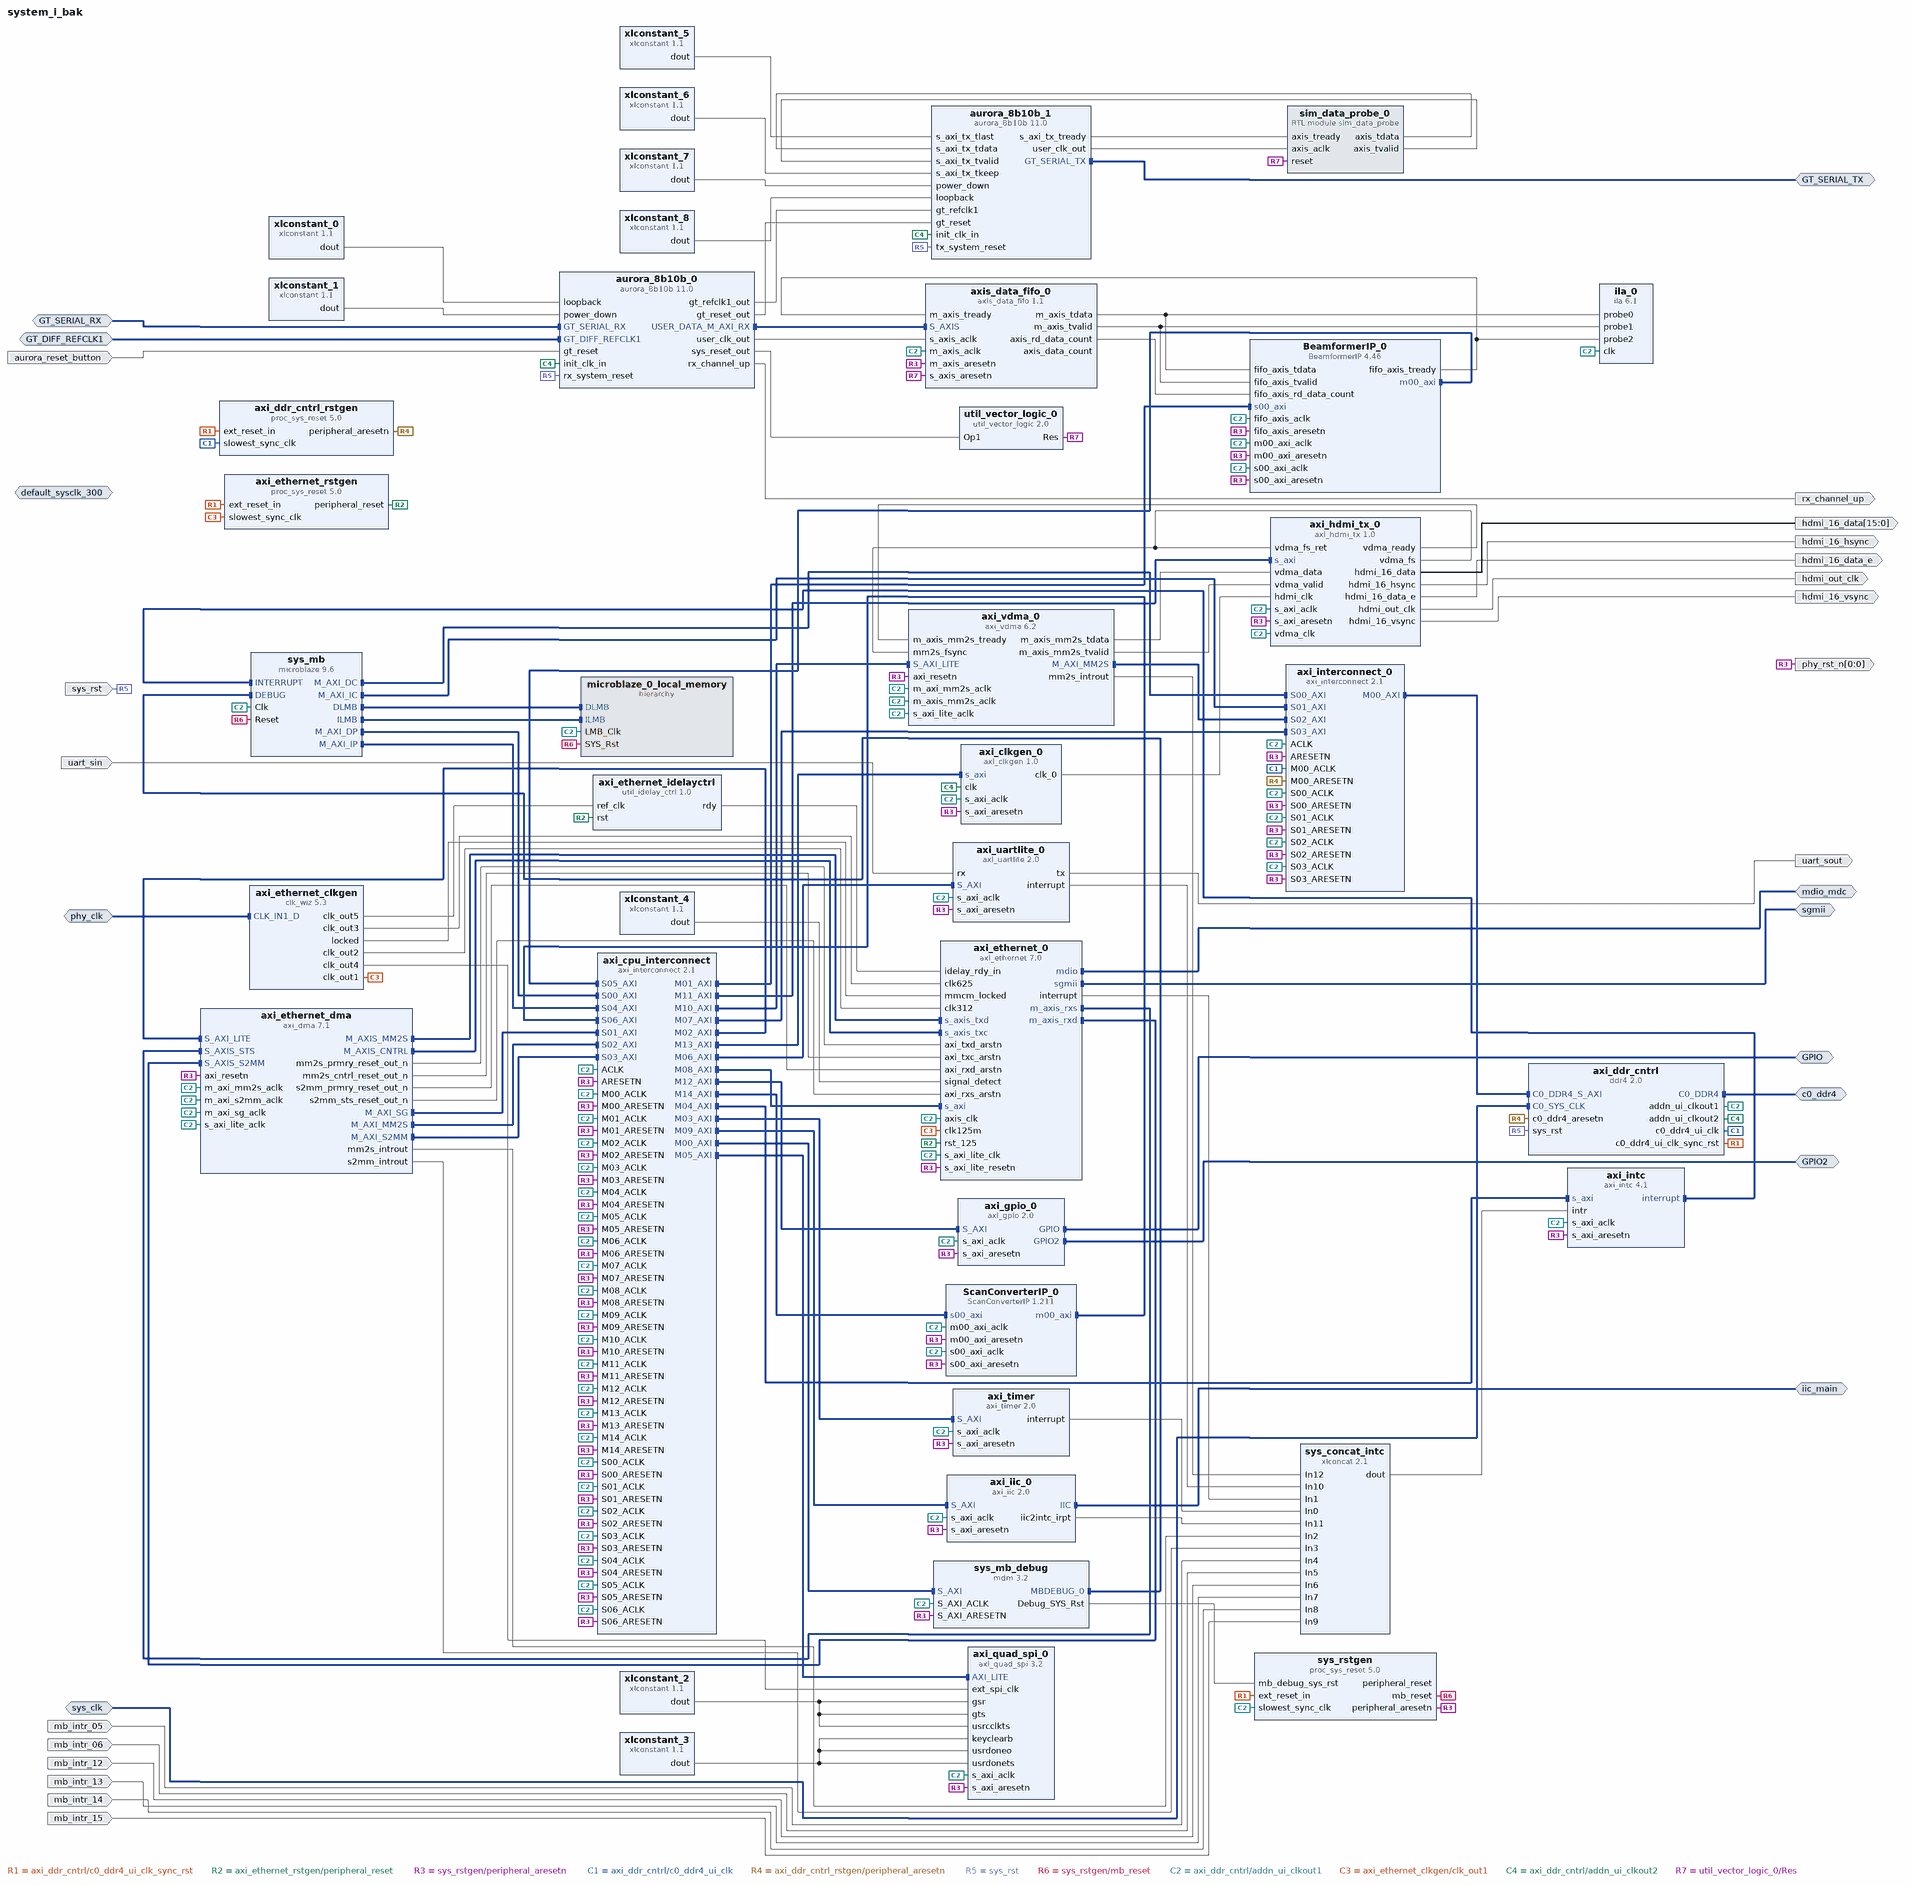
[diagram p0: block diagram of the top level]
# Vivado block design system_i_bak, Vivado 2016.1
create_bd_design system_i_bak

create_bd_intf_port -mode Master -vlnv xilinx.com:interface:ddr4_rtl:1.0 c0_ddr4
create_bd_intf_port -mode Slave -vlnv xilinx.com:interface:diff_clock_rtl:1.0 phy_clk
set_property -dict {CONFIG.FREQ_HZ 625000000} [get_bd_intf_ports phy_clk]
create_bd_intf_port -mode Slave -vlnv xilinx.com:interface:diff_clock_rtl:1.0 sys_clk
set_property -dict {CONFIG.FREQ_HZ 300000000} [get_bd_intf_ports sys_clk]
create_bd_intf_port -mode Master -vlnv xilinx.com:interface:mdio_rtl:1.0 mdio_mdc
create_bd_intf_port -mode Master -vlnv xilinx.com:interface:sgmii_rtl:1.0 sgmii
create_bd_intf_port -mode Master -vlnv xilinx.com:interface:iic_rtl:1.0 iic_main
create_bd_intf_port -mode Slave -vlnv xilinx.com:display_aurora:GT_Serial_Transceiver_Pins_RX_rtl:1.0 GT_SERIAL_RX
create_bd_intf_port -mode Slave -vlnv xilinx.com:interface:diff_clock_rtl:1.0 GT_DIFF_REFCLK1
set_property -dict {CONFIG.FREQ_HZ 125000000} [get_bd_intf_ports GT_DIFF_REFCLK1]
create_bd_intf_port -mode Master -vlnv xilinx.com:interface:gpio_rtl:1.0 GPIO
create_bd_intf_port -mode Master -vlnv xilinx.com:interface:gpio_rtl:1.0 GPIO2
create_bd_intf_port -mode Master -vlnv xilinx.com:display_aurora:GT_Serial_Transceiver_Pins_TX_rtl:1.0 GT_SERIAL_TX
create_bd_intf_port -mode Slave -vlnv xilinx.com:interface:diff_clock_rtl:1.0 default_sysclk_300
set_property -dict {CONFIG.FREQ_HZ 300000000} [get_bd_intf_ports default_sysclk_300]
create_bd_port -dir O uart_sout
create_bd_port -dir I -type intr mb_intr_05
create_bd_port -dir I -type intr mb_intr_06
create_bd_port -dir I -type intr mb_intr_12
create_bd_port -dir I -type intr mb_intr_13
create_bd_port -dir I -type intr mb_intr_14
create_bd_port -dir I -type intr mb_intr_15
create_bd_port -dir I uart_sin
create_bd_port -dir O -from 0 -to 0 -type rst phy_rst_n
create_bd_port -dir I -type rst sys_rst
set_property -dict {CONFIG.POLARITY ACTIVE_HIGH} [get_bd_ports sys_rst]
create_bd_port -dir O hdmi_out_clk
create_bd_port -dir O hdmi_16_hsync
create_bd_port -dir O hdmi_16_vsync
create_bd_port -dir O -from 15 -to 0 hdmi_16_data
create_bd_port -dir O hdmi_16_data_e
create_bd_port -dir O rx_channel_up
create_bd_port -dir I -type rst aurora_reset_button
set_property -dict {CONFIG.POLARITY ACTIVE_HIGH} [get_bd_ports aurora_reset_button]

create_bd_cell -type ip -vlnv xilinx.com:ip:axi_interconnect:2.1 axi_cpu_interconnect
set_property -dict [list \
  CONFIG.NUM_SI 7 \
  CONFIG.NUM_MI 15 \
  CONFIG.STRATEGY 1 \
  CONFIG.S00_HAS_DATA_FIFO 1 \
  CONFIG.S01_HAS_DATA_FIFO 1 \
  CONFIG.S02_HAS_DATA_FIFO 1 \
  CONFIG.S03_HAS_DATA_FIFO 1 \
  CONFIG.S04_HAS_DATA_FIFO 2 \
  CONFIG.S05_HAS_DATA_FIFO 2 \
  CONFIG.S06_HAS_DATA_FIFO 2 \
  CONFIG.S07_HAS_DATA_FIFO 1 \
  CONFIG.S08_HAS_DATA_FIFO 2 \
  CONFIG.S09_HAS_DATA_FIFO 2 \
] [get_bd_cells axi_cpu_interconnect]
create_bd_cell -type ip -vlnv xilinx.com:ip:ddr4:2.0 axi_ddr_cntrl
set_property -dict [list \
  CONFIG.RESET_BOARD_INTERFACE reset \
  CONFIG.C0_CLOCK_BOARD_INTERFACE Custom \
  CONFIG.C0_DDR4_BOARD_INTERFACE ddr4_sdram \
  CONFIG.C0.DDR4_TimePeriod 833 \
  CONFIG.C0.DDR4_InputClockPeriod 3332 \
  CONFIG.C0.DDR4_MemoryPart EDY4016AABG-DR-F \
  CONFIG.C0.DDR4_DataWidth 64 \
  CONFIG.C0.DDR4_CasWriteLatency 12 \
  CONFIG.C0.DDR4_Mem_Add_Map ROW_COLUMN_BANK \
  CONFIG.ADDN_UI_CLKOUT1_FREQ_HZ 133 \
  CONFIG.ADDN_UI_CLKOUT2_FREQ_HZ 200 \
  CONFIG.Debug_Signal Disable \
] [get_bd_cells axi_ddr_cntrl]
create_bd_cell -type ip -vlnv xilinx.com:ip:proc_sys_reset:5.0 axi_ddr_cntrl_rstgen
create_bd_cell -type ip -vlnv xilinx.com:ip:clk_wiz:5.3 axi_ethernet_clkgen
set_property -dict [list \
  CONFIG.PRIM_IN_FREQ 625.000 \
  CONFIG.CLKOUT2_USED true \
  CONFIG.CLKOUT3_USED true \
  CONFIG.CLKOUT4_USED true \
  CONFIG.CLKOUT5_USED true \
  CONFIG.CLKOUT6_USED false \
  CONFIG.NUM_OUT_CLKS 5 \
  CONFIG.CLKOUT1_REQUESTED_OUT_FREQ 125 \
  CONFIG.CLKOUT2_REQUESTED_OUT_FREQ 312 \
  CONFIG.CLKOUT3_REQUESTED_OUT_FREQ 625 \
  CONFIG.CLKOUT4_REQUESTED_OUT_FREQ 108 \
  CONFIG.CLKOUT5_REQUESTED_OUT_FREQ 208 \
  CONFIG.CLKOUT6_REQUESTED_OUT_FREQ 208 \
  CONFIG.PRIM_SOURCE Differential_clock_capable_pin \
  CONFIG.CLKOUT3_DRIVES BUFG \
  CONFIG.CLKOUT6_DRIVES BUFG \
  CONFIG.USE_LOCKED true \
  CONFIG.USE_RESET false \
  CONFIG.MMCM_DIVCLK_DIVIDE 2 \
  CONFIG.MMCM_CLKIN1_PERIOD 1.6 \
  CONFIG.MMCM_CLKOUT3_DIVIDE 12 \
  CONFIG.MMCM_CLKOUT4_DIVIDE 6 \
  CONFIG.MMCM_CLKOUT5_DIVIDE 1 \
  CONFIG.CLK_IN1_BOARD_INTERFACE sgmii_phyclk \
  CONFIG.RESET_BOARD_INTERFACE Custom \
  CONFIG.CLKOUT4_JITTER 99.367 \
  CONFIG.CLKOUT4_PHASE_ERROR 76.196 \
  CONFIG.CLKOUT5_JITTER 86.709 \
  CONFIG.CLKOUT5_PHASE_ERROR 76.196 \
  CONFIG.CLKOUT6_JITTER 86.709 \
  CONFIG.CLKOUT6_PHASE_ERROR 76.196 \
] [get_bd_cells axi_ethernet_clkgen]
create_bd_cell -type ip -vlnv xilinx.com:ip:axi_dma:7.1 axi_ethernet_dma
set_property -dict [list \
  CONFIG.c_sg_length_width 16 \
  CONFIG.c_include_mm2s_dre 1 \
  CONFIG.c_sg_use_stsapp_length 1 \
  CONFIG.c_include_s2mm_dre 1 \
] [get_bd_cells axi_ethernet_dma]
create_bd_cell -type ip -vlnv xilinx.com:ip:util_idelay_ctrl:1.0 axi_ethernet_idelayctrl
create_bd_cell -type ip -vlnv xilinx.com:ip:proc_sys_reset:5.0 axi_ethernet_rstgen
set_property -dict {CONFIG.RESET_BOARD_INTERFACE Custom} [get_bd_cells axi_ethernet_rstgen]
create_bd_cell -type ip -vlnv xilinx.com:ip:axi_intc:4.1 axi_intc
set_property -dict {CONFIG.C_HAS_FAST 0} [get_bd_cells axi_intc]
create_bd_cell -type ip -vlnv xilinx.com:ip:axi_timer:2.0 axi_timer
create_bd_cell -type ip -vlnv xilinx.com:ip:axi_uartlite:2.0 axi_uartlite_0
set_property -dict {CONFIG.UARTLITE_BOARD_INTERFACE rs232_uart} [get_bd_cells axi_uartlite_0]
create_bd_cell -type hier microblaze_0_local_memory
create_bd_cell -type ip -vlnv xilinx.com:ip:xlconcat:2.1 sys_concat_intc
set_property -dict {CONFIG.NUM_PORTS 13} [get_bd_cells sys_concat_intc]
create_bd_cell -type ip -vlnv xilinx.com:ip:microblaze:9.6 sys_mb
set_property -dict [list \
  CONFIG.C_D_LMB 1 \
  CONFIG.C_I_AXI 1 \
  CONFIG.C_I_LMB 1 \
  CONFIG.G_TEMPLATE_LIST 6 \
  CONFIG.G_USE_EXCEPTIONS 1 \
  CONFIG.C_USE_MSR_INSTR 1 \
  CONFIG.C_USE_PCMP_INSTR 1 \
  CONFIG.C_USE_REORDER_INSTR 1 \
  CONFIG.C_USE_BARREL 1 \
  CONFIG.C_USE_DIV 0 \
  CONFIG.C_USE_HW_MUL 1 \
  CONFIG.C_USE_FPU 0 \
  CONFIG.C_UNALIGNED_EXCEPTIONS 0 \
  CONFIG.C_ILL_OPCODE_EXCEPTION 0 \
  CONFIG.C_M_AXI_I_BUS_EXCEPTION 0 \
  CONFIG.C_M_AXI_D_BUS_EXCEPTION 1 \
  CONFIG.C_PVR 0 \
  CONFIG.C_DEBUG_ENABLED 1 \
  CONFIG.C_NUMBER_OF_PC_BRK 2 \
  CONFIG.C_OPCODE_0x0_ILLEGAL 0 \
  CONFIG.C_FSL_LINKS 0 \
  CONFIG.C_USE_ICACHE 1 \
  CONFIG.C_CACHE_BYTE_SIZE 4096 \
  CONFIG.C_ICACHE_LINE_LEN 8 \
  CONFIG.C_ICACHE_VICTIMS 0 \
  CONFIG.C_ICACHE_STREAMS 0 \
  CONFIG.C_USE_DCACHE 1 \
  CONFIG.C_DCACHE_BYTE_SIZE 4096 \
  CONFIG.C_DCACHE_LINE_LEN 4 \
  CONFIG.C_DCACHE_USE_WRITEBACK 0 \
  CONFIG.C_USE_MMU 3 \
  CONFIG.C_MMU_DTLB_SIZE 4 \
  CONFIG.C_MMU_ITLB_SIZE 2 \
  CONFIG.C_USE_BRANCH_TARGET_CACHE 0 \
] [get_bd_cells sys_mb]
create_bd_cell -type ip -vlnv xilinx.com:ip:mdm:3.2 sys_mb_debug
set_property -dict {CONFIG.C_USE_UART 1} [get_bd_cells sys_mb_debug]
create_bd_cell -type ip -vlnv xilinx.com:ip:proc_sys_reset:5.0 sys_rstgen
create_bd_cell -type ip -vlnv xilinx.com:ip:axi_quad_spi:3.2 axi_quad_spi_0
set_property -dict [list \
  CONFIG.C_SPI_MEMORY 2 \
  CONFIG.C_USE_STARTUP 1 \
  CONFIG.C_USE_STARTUP_INT 1 \
  CONFIG.C_SPI_MODE 2 \
] [get_bd_cells axi_quad_spi_0]
create_bd_cell -type ip -vlnv xilinx.com:ip:axi_ethernet:7.0 axi_ethernet_0
set_property -dict [list \
  CONFIG.ETHERNET_BOARD_INTERFACE sgmii \
  CONFIG.MDIO_BOARD_INTERFACE mdio_mdc \
  CONFIG.SupportLevel 0 \
  CONFIG.Statistics_Counters false \
  CONFIG.axiliteclkrate 133 \
  CONFIG.axisclkrate 133 \
] [get_bd_cells axi_ethernet_0]
create_bd_cell -type ip -vlnv xilinx.com:ip:axi_iic:2.0 axi_iic_0
set_property -dict {CONFIG.USE_BOARD_FLOW true CONFIG.IIC_BOARD_INTERFACE iic_main} [get_bd_cells axi_iic_0]
create_bd_cell -type ip -vlnv xilinx.com:ip:axi_vdma:6.2 axi_vdma_0
set_property -dict [list \
  CONFIG.c_m_axis_mm2s_tdata_width 64 \
  CONFIG.c_use_mm2s_fsync 1 \
  CONFIG.c_include_s2mm 0 \
] [get_bd_cells axi_vdma_0]
create_bd_cell -type ip -vlnv xilinx.com:ip:axi_gpio:2.0 axi_gpio_0
set_property -dict [list \
  CONFIG.C_GPIO_WIDTH 7 \
  CONFIG.C_GPIO2_WIDTH 4 \
  CONFIG.C_IS_DUAL 1 \
  CONFIG.C_ALL_INPUTS 0 \
  CONFIG.C_ALL_INPUTS_2 1 \
  CONFIG.USE_BOARD_FLOW true \
  CONFIG.GPIO_BOARD_INTERFACE Custom \
  CONFIG.GPIO2_BOARD_INTERFACE Custom \
  CONFIG.C_ALL_OUTPUTS 1 \
] [get_bd_cells axi_gpio_0]
create_bd_cell -type ip -vlnv analog.com:user:axi_hdmi_tx:1.0 axi_hdmi_tx_0
set_property -dict {CONFIG.DEVICE_TYPE 1} [get_bd_cells axi_hdmi_tx_0]
create_bd_cell -type ip -vlnv analog.com:user:axi_clkgen:1.0 axi_clkgen_0
create_bd_cell -type ip -vlnv xilinx.com:ip:aurora_8b10b:11.0 aurora_8b10b_0
set_property -dict [list \
  CONFIG.C_AURORA_LANES 4 \
  CONFIG.C_LINE_RATE 6.25 \
  CONFIG.Dataflow_Config RX-only_Simplex \
  CONFIG.Backchannel_mode Timer \
  CONFIG.C_START_QUAD Quad_X0Y4 \
  CONFIG.C_START_LANE X0Y16 \
  CONFIG.C_REFCLK_SOURCE {MGTREFCLK0 of Quad X0Y4} \
  CONFIG.SupportLevel 1 \
  CONFIG.C_USE_BYTESWAP true \
  CONFIG.CHANNEL_ENABLE {X0Y16 X0Y17 X0Y18 X0Y19} \
  CONFIG.C_DRP_IF false \
] [get_bd_cells aurora_8b10b_0]
create_bd_cell -type ip -vlnv xilinx.com:ip:util_vector_logic:2.0 util_vector_logic_0
set_property -dict {CONFIG.C_SIZE 1 CONFIG.C_OPERATION not} [get_bd_cells util_vector_logic_0]
create_bd_cell -type ip -vlnv xilinx.com:ip:axis_data_fifo:1.1 axis_data_fifo_0
set_property -dict {CONFIG.TDATA_NUM_BYTES 8 CONFIG.FIFO_DEPTH 32768 CONFIG.IS_ACLK_ASYNC 1} [get_bd_cells axis_data_fifo_0]
create_bd_cell -type ip -vlnv xilinx.com:ip:xlconstant:1.1 xlconstant_0
set_property -dict {CONFIG.CONST_WIDTH 3 CONFIG.CONST_VAL 0} [get_bd_cells xlconstant_0]
create_bd_cell -type ip -vlnv xilinx.com:ip:xlconstant:1.1 xlconstant_1
set_property -dict {CONFIG.CONST_WIDTH 1 CONFIG.CONST_VAL 0} [get_bd_cells xlconstant_1]
create_bd_cell -type ip -vlnv xilinx.com:ip:xlconstant:1.1 xlconstant_2
set_property -dict {CONFIG.CONST_VAL 0} [get_bd_cells xlconstant_2]
create_bd_cell -type ip -vlnv xilinx.com:ip:xlconstant:1.1 xlconstant_3
create_bd_cell -type ip -vlnv xilinx.com:ip:xlconstant:1.1 xlconstant_4
create_bd_cell -type ip -vlnv xilinx.com:ip:aurora_8b10b:11.0 aurora_8b10b_1
set_property -dict [list \
  CONFIG.C_AURORA_LANES 4 \
  CONFIG.C_LINE_RATE 6.25 \
  CONFIG.Dataflow_Config TX-only_Simplex \
  CONFIG.Backchannel_mode Timer \
  CONFIG.C_START_QUAD Quad_X0Y3 \
  CONFIG.C_START_LANE X0Y12 \
  CONFIG.C_REFCLK_SOURCE {MGTREFCLK0 of Quad X0Y3} \
  CONFIG.SINGLEEND_GTREFCLK true \
  CONFIG.SupportLevel 1 \
  CONFIG.C_USE_BYTESWAP true \
  CONFIG.CHANNEL_ENABLE {X0Y12 X0Y13 X0Y14 X0Y15} \
  CONFIG.C_DRP_IF false \
] [get_bd_cells aurora_8b10b_1]
create_bd_cell -type ip -vlnv xilinx.com:ip:xlconstant:1.1 xlconstant_5
create_bd_cell -type ip -vlnv xilinx.com:ip:xlconstant:1.1 xlconstant_6
set_property -dict {CONFIG.CONST_WIDTH 8 CONFIG.CONST_VAL 255} [get_bd_cells xlconstant_6]
create_bd_cell -type ip -vlnv xilinx.com:ip:xlconstant:1.1 xlconstant_7
set_property -dict {CONFIG.CONST_VAL 0} [get_bd_cells xlconstant_7]
create_bd_cell -type ip -vlnv xilinx.com:ip:xlconstant:1.1 xlconstant_8
set_property -dict {CONFIG.CONST_WIDTH 3 CONFIG.CONST_VAL 0} [get_bd_cells xlconstant_8]
create_bd_cell -type ip -vlnv xilinx.com:ip:ila:6.1 ila_0
set_property -dict [list \
  CONFIG.C_PROBE0_WIDTH 64 \
  CONFIG.C_NUM_OF_PROBES 3 \
  CONFIG.C_ADV_TRIGGER true \
  CONFIG.C_TRIGIN_EN true \
  CONFIG.C_ENABLE_ILA_AXI_MON false \
  CONFIG.C_MONITOR_TYPE Native \
] [get_bd_cells ila_0]
create_bd_cell -type ip -vlnv xilinx.com:ip:axi_interconnect:2.1 axi_interconnect_0
set_property -dict [list \
  CONFIG.NUM_SI 4 \
  CONFIG.NUM_MI 1 \
  CONFIG.STRATEGY 2 \
  CONFIG.S00_HAS_DATA_FIFO 2 \
  CONFIG.S01_HAS_DATA_FIFO 2 \
  CONFIG.S02_HAS_DATA_FIFO 2 \
  CONFIG.S03_HAS_DATA_FIFO 2 \
] [get_bd_cells axi_interconnect_0]
create_bd_cell -type module -reference sim_data_probe sim_data_probe_0
create_bd_cell -type ip -vlnv lsi.epfl.ch:user:BeamformerIP:4.46 BeamformerIP_0
set_property -dict {CONFIG.NAPPE_BUFFER_DEPTH 3} [get_bd_cells BeamformerIP_0]
create_bd_cell -type ip -vlnv lsi.epfl.ch:user:ScanConverterIP:1.211 ScanConverterIP_0
set_property -dict [list \
  CONFIG.C_S00_AXI_AWUSER_WIDTH 0 \
  CONFIG.C_S00_AXI_ARUSER_WIDTH 0 \
  CONFIG.C_S00_AXI_WUSER_WIDTH 0 \
  CONFIG.C_S00_AXI_RUSER_WIDTH 0 \
  CONFIG.C_S00_AXI_BUSER_WIDTH 0 \
] [get_bd_cells ScanConverterIP_0]

# ---- hierarchy /microblaze_0_local_memory ----
current_bd_instance /microblaze_0_local_memory
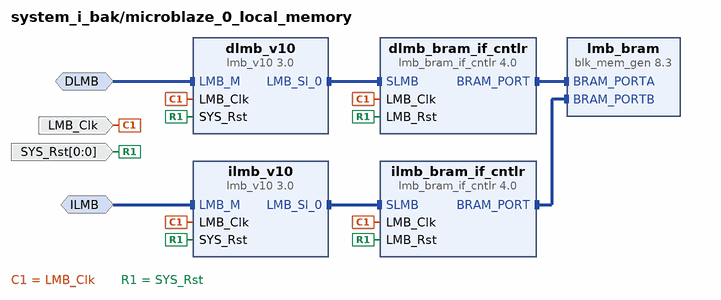
[diagram p1: block diagram inside /microblaze_0_local_memory]
create_bd_intf_pin -mode MirroredMaster -vlnv xilinx.com:interface:lmb_rtl:1.0 DLMB
create_bd_intf_pin -mode MirroredMaster -vlnv xilinx.com:interface:lmb_rtl:1.0 ILMB
create_bd_pin -dir I -type clk LMB_Clk
create_bd_pin -dir I -from 0 -to 0 -type rst SYS_Rst

create_bd_cell -type ip -vlnv xilinx.com:ip:lmb_v10:3.0 dlmb_v10
create_bd_cell -type ip -vlnv xilinx.com:ip:lmb_v10:3.0 ilmb_v10
create_bd_cell -type ip -vlnv xilinx.com:ip:lmb_bram_if_cntlr:4.0 dlmb_bram_if_cntlr
set_property -dict {CONFIG.C_ECC 0} [get_bd_cells dlmb_bram_if_cntlr]
create_bd_cell -type ip -vlnv xilinx.com:ip:lmb_bram_if_cntlr:4.0 ilmb_bram_if_cntlr
set_property -dict {CONFIG.C_ECC 0} [get_bd_cells ilmb_bram_if_cntlr]
create_bd_cell -type ip -vlnv xilinx.com:ip:blk_mem_gen:8.3 lmb_bram
set_property -dict {CONFIG.Memory_Type True_Dual_Port_RAM CONFIG.use_bram_block BRAM_Controller} [get_bd_cells lmb_bram]

# ---- connections ----

current_bd_instance /microblaze_0_local_memory
connect_bd_intf_net -intf_net microblaze_0_dlmb_bus [get_bd_intf_pins dlmb_v10/LMB_Sl_0] [get_bd_intf_pins dlmb_bram_if_cntlr/SLMB]
connect_bd_intf_net -intf_net microblaze_0_ilmb_bus [get_bd_intf_pins ilmb_v10/LMB_Sl_0] [get_bd_intf_pins ilmb_bram_if_cntlr/SLMB]
connect_bd_intf_net -intf_net microblaze_0_dlmb_cntlr [get_bd_intf_pins dlmb_bram_if_cntlr/BRAM_PORT] [get_bd_intf_pins lmb_bram/BRAM_PORTA]
connect_bd_intf_net -intf_net microblaze_0_ilmb_cntlr [get_bd_intf_pins ilmb_bram_if_cntlr/BRAM_PORT] [get_bd_intf_pins lmb_bram/BRAM_PORTB]
connect_bd_intf_net -intf_net microblaze_0_dlmb [get_bd_intf_pins DLMB] [get_bd_intf_pins dlmb_v10/LMB_M]
connect_bd_intf_net -intf_net microblaze_0_ilmb [get_bd_intf_pins ILMB] [get_bd_intf_pins ilmb_v10/LMB_M]
connect_bd_net -net microblaze_0_Clk [get_bd_pins LMB_Clk] \
  [get_bd_pins dlmb_v10/LMB_Clk] [get_bd_pins dlmb_bram_if_cntlr/LMB_Clk] [get_bd_pins ilmb_v10/LMB_Clk] \
  [get_bd_pins ilmb_bram_if_cntlr/LMB_Clk]
connect_bd_net [get_bd_pins SYS_Rst] \
  [get_bd_pins ilmb_v10/SYS_Rst] [get_bd_pins dlmb_v10/SYS_Rst] [get_bd_pins dlmb_bram_if_cntlr/LMB_Rst] \
  [get_bd_pins ilmb_bram_if_cntlr/LMB_Rst]

current_bd_instance /
connect_bd_intf_net [get_bd_intf_pins axi_cpu_interconnect/S00_AXI] [get_bd_intf_pins sys_mb/M_AXI_DP]
connect_bd_intf_net [get_bd_intf_pins axi_cpu_interconnect/M00_AXI] [get_bd_intf_pins sys_mb_debug/S_AXI]
connect_bd_intf_net [get_bd_intf_pins axi_cpu_interconnect/M02_AXI] [get_bd_intf_pins axi_ethernet_dma/S_AXI_LITE]
connect_bd_intf_net [get_bd_intf_pins axi_timer/S_AXI] [get_bd_intf_pins axi_cpu_interconnect/M03_AXI]
connect_bd_intf_net [get_bd_intf_pins axi_intc/s_axi] [get_bd_intf_pins axi_cpu_interconnect/M04_AXI]
connect_bd_intf_net [get_bd_intf_pins axi_intc/interrupt] [get_bd_intf_pins sys_mb/INTERRUPT]
connect_bd_intf_net [get_bd_intf_pins microblaze_0_local_memory/DLMB] [get_bd_intf_pins sys_mb/DLMB]
connect_bd_intf_net [get_bd_intf_pins microblaze_0_local_memory/ILMB] [get_bd_intf_pins sys_mb/ILMB]
connect_bd_intf_net [get_bd_intf_pins sys_mb_debug/MBDEBUG_0] [get_bd_intf_pins sys_mb/DEBUG]
connect_bd_intf_net [get_bd_intf_pins axi_ethernet_dma/M_AXI_SG] [get_bd_intf_pins axi_cpu_interconnect/S01_AXI]
connect_bd_intf_net [get_bd_intf_pins axi_ethernet_dma/M_AXI_MM2S] [get_bd_intf_pins axi_cpu_interconnect/S02_AXI]
connect_bd_intf_net [get_bd_intf_pins axi_ethernet_dma/M_AXI_S2MM] [get_bd_intf_pins axi_cpu_interconnect/S03_AXI]
connect_bd_intf_net [get_bd_intf_pins axi_uartlite_0/S_AXI] [get_bd_intf_pins axi_cpu_interconnect/M06_AXI]
connect_bd_intf_net [get_bd_intf_pins axi_cpu_interconnect/M01_AXI] [get_bd_intf_pins BeamformerIP_0/s00_axi]
connect_bd_intf_net [get_bd_intf_pins axi_cpu_interconnect/M05_AXI] [get_bd_intf_pins axi_quad_spi_0/AXI_LITE]
connect_bd_intf_net [get_bd_intf_pins axi_ethernet_dma/M_AXIS_MM2S] [get_bd_intf_pins axi_ethernet_0/s_axis_txd]
connect_bd_intf_net [get_bd_intf_pins axi_ethernet_dma/M_AXIS_CNTRL] [get_bd_intf_pins axi_ethernet_0/s_axis_txc]
connect_bd_intf_net [get_bd_intf_pins axi_ethernet_dma/S_AXIS_STS] [get_bd_intf_pins axi_ethernet_0/m_axis_rxs]
connect_bd_intf_net [get_bd_intf_pins axi_ethernet_dma/S_AXIS_S2MM] [get_bd_intf_pins axi_ethernet_0/m_axis_rxd]
connect_bd_intf_net [get_bd_intf_pins axi_cpu_interconnect/M08_AXI] [get_bd_intf_pins axi_ethernet_0/s_axi]
connect_bd_intf_net [get_bd_intf_pins axi_cpu_interconnect/M09_AXI] [get_bd_intf_pins axi_iic_0/S_AXI]
connect_bd_intf_net [get_bd_intf_pins axi_cpu_interconnect/M10_AXI] [get_bd_intf_pins axi_vdma_0/S_AXI_LITE]
connect_bd_intf_net [get_bd_intf_pins axi_cpu_interconnect/M11_AXI] [get_bd_intf_pins axi_hdmi_tx_0/s_axi]
connect_bd_intf_net [get_bd_intf_pins axi_cpu_interconnect/M12_AXI] [get_bd_intf_pins axi_gpio_0/S_AXI]
connect_bd_intf_net [get_bd_intf_pins axi_cpu_interconnect/M13_AXI] [get_bd_intf_pins axi_clkgen_0/s_axi]
connect_bd_intf_net [get_bd_intf_pins axi_cpu_interconnect/M14_AXI] [get_bd_intf_pins ScanConverterIP_0/s00_axi]
connect_bd_intf_net [get_bd_intf_pins aurora_8b10b_0/USER_DATA_M_AXI_RX] [get_bd_intf_pins axis_data_fifo_0/S_AXIS]
connect_bd_intf_net [get_bd_intf_pins axi_interconnect_0/M00_AXI] [get_bd_intf_pins axi_ddr_cntrl/C0_DDR4_S_AXI]
connect_bd_intf_net [get_bd_intf_pins sys_mb/M_AXI_DC] [get_bd_intf_pins axi_interconnect_0/S00_AXI]
connect_bd_intf_net [get_bd_intf_pins sys_mb/M_AXI_IC] [get_bd_intf_pins axi_interconnect_0/S01_AXI]
connect_bd_intf_net [get_bd_intf_pins axi_vdma_0/M_AXI_MM2S] [get_bd_intf_pins axi_interconnect_0/S02_AXI]
connect_bd_intf_net [get_bd_intf_pins axi_cpu_interconnect/M07_AXI] [get_bd_intf_pins axi_interconnect_0/S03_AXI]
connect_bd_intf_net [get_bd_intf_pins ScanConverterIP_0/m00_axi] [get_bd_intf_pins axi_cpu_interconnect/S06_AXI]
connect_bd_intf_net [get_bd_intf_pins axi_cpu_interconnect/S05_AXI] [get_bd_intf_pins BeamformerIP_0/m00_axi]
connect_bd_intf_net [get_bd_intf_pins sys_mb/M_AXI_IP] [get_bd_intf_pins axi_cpu_interconnect/S04_AXI]
connect_bd_intf_net [get_bd_intf_ports c0_ddr4] [get_bd_intf_pins axi_ddr_cntrl/C0_DDR4]
connect_bd_intf_net [get_bd_intf_ports phy_clk] [get_bd_intf_pins axi_ethernet_clkgen/CLK_IN1_D]
connect_bd_intf_net [get_bd_intf_ports sys_clk] [get_bd_intf_pins axi_ddr_cntrl/C0_SYS_CLK]
connect_bd_intf_net [get_bd_intf_ports mdio_mdc] [get_bd_intf_pins axi_ethernet_0/mdio]
connect_bd_intf_net [get_bd_intf_ports sgmii] [get_bd_intf_pins axi_ethernet_0/sgmii]
connect_bd_intf_net [get_bd_intf_ports iic_main] [get_bd_intf_pins axi_iic_0/IIC]
connect_bd_intf_net [get_bd_intf_ports GT_SERIAL_RX] [get_bd_intf_pins aurora_8b10b_0/GT_SERIAL_RX]
connect_bd_intf_net -intf_net GT_DIFF_REFCLK1_1 [get_bd_intf_ports GT_DIFF_REFCLK1] [get_bd_intf_pins aurora_8b10b_0/GT_DIFF_REFCLK1]
connect_bd_intf_net [get_bd_intf_ports GPIO] [get_bd_intf_pins axi_gpio_0/GPIO]
connect_bd_intf_net [get_bd_intf_ports GPIO2] [get_bd_intf_pins axi_gpio_0/GPIO2]
connect_bd_intf_net [get_bd_intf_ports GT_SERIAL_TX] [get_bd_intf_pins aurora_8b10b_1/GT_SERIAL_TX]
connect_bd_net [get_bd_pins axi_ddr_cntrl/c0_ddr4_ui_clk_sync_rst] \
  [get_bd_pins sys_rstgen/ext_reset_in] [get_bd_pins axi_ethernet_rstgen/ext_reset_in] \
  [get_bd_pins axi_ddr_cntrl_rstgen/ext_reset_in]
connect_bd_net [get_bd_pins axi_ethernet_clkgen/clk_out3] [get_bd_pins axi_ethernet_0/clk625]
connect_bd_net [get_bd_pins axi_ethernet_dma/mm2s_introut] [get_bd_pins sys_concat_intc/In2]
connect_bd_net [get_bd_pins axi_ethernet_dma/s2mm_introut] [get_bd_pins sys_concat_intc/In3]
connect_bd_net [get_bd_pins axi_ethernet_rstgen/peripheral_reset] [get_bd_pins axi_ethernet_0/rst_125] [get_bd_pins axi_ethernet_idelayctrl/rst]
connect_bd_net [get_bd_pins axi_timer/interrupt] [get_bd_pins sys_concat_intc/In0]
connect_bd_net [get_bd_pins axi_uartlite_0/interrupt] [get_bd_pins sys_concat_intc/In10]
connect_bd_net [get_bd_pins axi_uartlite_0/tx] [get_bd_ports uart_sout]
connect_bd_net -net mb_intr_05_1 [get_bd_ports mb_intr_05] [get_bd_pins sys_concat_intc/In4]
connect_bd_net -net mb_intr_06_1 [get_bd_ports mb_intr_06] [get_bd_pins sys_concat_intc/In5]
connect_bd_net -net mb_intr_12_1 [get_bd_ports mb_intr_12] [get_bd_pins sys_concat_intc/In6]
connect_bd_net -net mb_intr_13_1 [get_bd_ports mb_intr_13] [get_bd_pins sys_concat_intc/In7]
connect_bd_net -net mb_intr_14_1 [get_bd_ports mb_intr_14] [get_bd_pins sys_concat_intc/In8]
connect_bd_net -net mb_intr_15_1 [get_bd_ports mb_intr_15] [get_bd_pins sys_concat_intc/In9]
connect_bd_net -net rx_1 [get_bd_ports uart_sin] [get_bd_pins axi_uartlite_0/rx]
connect_bd_net [get_bd_pins sys_concat_intc/dout] [get_bd_pins axi_intc/intr]
# net sys_cpu_reset has one end: sys_rstgen/peripheral_reset
connect_bd_net -net sys_cpu_resetn [get_bd_pins sys_rstgen/peripheral_aresetn] \
  [get_bd_ports phy_rst_n] [get_bd_pins sys_mb_debug/S_AXI_ARESETN] [get_bd_pins axi_ethernet_dma/axi_resetn] \
  [get_bd_pins axi_timer/s_axi_aresetn] [get_bd_pins axi_intc/s_axi_aresetn] [get_bd_pins axi_uartlite_0/s_axi_aresetn] \
  [get_bd_pins axi_quad_spi_0/s_axi_aresetn] [get_bd_pins axi_ethernet_0/s_axi_lite_resetn] \
  [get_bd_pins axi_iic_0/s_axi_aresetn] [get_bd_pins axi_vdma_0/axi_resetn] [get_bd_pins axi_gpio_0/s_axi_aresetn] \
  [get_bd_pins axi_hdmi_tx_0/s_axi_aresetn] [get_bd_pins axi_clkgen_0/s_axi_aresetn] \
  [get_bd_pins axis_data_fifo_0/m_axis_aresetn] [get_bd_pins BeamformerIP_0/fifo_axis_aresetn] \
  [get_bd_pins BeamformerIP_0/s00_axi_aresetn] [get_bd_pins BeamformerIP_0/m00_axi_aresetn] \
  [get_bd_pins axi_cpu_interconnect/ARESETN] [get_bd_pins axi_cpu_interconnect/S00_ARESETN] \
  [get_bd_pins axi_cpu_interconnect/M00_ARESETN] [get_bd_pins axi_cpu_interconnect/M01_ARESETN] \
  [get_bd_pins axi_cpu_interconnect/M02_ARESETN] [get_bd_pins axi_cpu_interconnect/M03_ARESETN] \
  [get_bd_pins axi_cpu_interconnect/M04_ARESETN] [get_bd_pins axi_cpu_interconnect/M05_ARESETN] \
  [get_bd_pins axi_cpu_interconnect/M06_ARESETN] [get_bd_pins axi_cpu_interconnect/S01_ARESETN] \
  [get_bd_pins axi_cpu_interconnect/S02_ARESETN] [get_bd_pins axi_cpu_interconnect/S03_ARESETN] \
  [get_bd_pins axi_cpu_interconnect/S04_ARESETN] [get_bd_pins axi_cpu_interconnect/M08_ARESETN] \
  [get_bd_pins axi_cpu_interconnect/M09_ARESETN] [get_bd_pins axi_cpu_interconnect/M10_ARESETN] \
  [get_bd_pins axi_cpu_interconnect/M11_ARESETN] [get_bd_pins axi_cpu_interconnect/M12_ARESETN] \
  [get_bd_pins axi_cpu_interconnect/S05_ARESETN] [get_bd_pins axi_cpu_interconnect/M13_ARESETN] \
  [get_bd_pins axi_cpu_interconnect/S06_ARESETN] [get_bd_pins axi_cpu_interconnect/M14_ARESETN] \
  [get_bd_pins axi_interconnect_0/S01_ARESETN] [get_bd_pins axi_interconnect_0/S03_ARESETN] \
  [get_bd_pins axi_interconnect_0/S02_ARESETN] [get_bd_pins axi_interconnect_0/S00_ARESETN] \
  [get_bd_pins axi_interconnect_0/ARESETN] [get_bd_pins axi_cpu_interconnect/M07_ARESETN] \
  [get_bd_pins ScanConverterIP_0/s00_axi_aresetn] [get_bd_pins ScanConverterIP_0/m00_axi_aresetn]
connect_bd_net [get_bd_pins sys_mb_debug/Debug_SYS_Rst] [get_bd_pins sys_rstgen/mb_debug_sys_rst]
connect_bd_net -net sys_mem_clk [get_bd_pins axi_ddr_cntrl/c0_ddr4_ui_clk] \
  [get_bd_pins axi_ddr_cntrl_rstgen/slowest_sync_clk] [get_bd_pins axi_interconnect_0/M00_ACLK]
connect_bd_net -net sys_mem_resetn [get_bd_pins axi_ddr_cntrl_rstgen/peripheral_aresetn] \
  [get_bd_pins axi_ddr_cntrl/c0_ddr4_aresetn] [get_bd_pins axi_interconnect_0/M00_ARESETN]
connect_bd_net [get_bd_ports sys_rst] \
  [get_bd_pins axi_ddr_cntrl/sys_rst] [get_bd_pins aurora_8b10b_0/rx_system_reset] \
  [get_bd_pins aurora_8b10b_1/tx_system_reset]
connect_bd_net [get_bd_pins sys_rstgen/mb_reset] [get_bd_pins sys_mb/Reset] [get_bd_pins microblaze_0_local_memory/SYS_Rst]
connect_bd_net [get_bd_pins axi_ethernet_clkgen/clk_out4] [get_bd_pins axi_quad_spi_0/ext_spi_clk]
connect_bd_net [get_bd_pins axi_ethernet_dma/mm2s_prmry_reset_out_n] [get_bd_pins axi_ethernet_0/axi_txd_arstn]
connect_bd_net [get_bd_pins axi_ethernet_dma/mm2s_cntrl_reset_out_n] [get_bd_pins axi_ethernet_0/axi_txc_arstn]
connect_bd_net [get_bd_pins axi_ethernet_dma/s2mm_prmry_reset_out_n] [get_bd_pins axi_ethernet_0/axi_rxd_arstn]
connect_bd_net [get_bd_pins axi_ethernet_dma/s2mm_sts_reset_out_n] [get_bd_pins axi_ethernet_0/axi_rxs_arstn]
connect_bd_net [get_bd_pins axi_ethernet_clkgen/locked] [get_bd_pins axi_ethernet_0/mmcm_locked]
connect_bd_net [get_bd_pins axi_ethernet_clkgen/clk_out2] [get_bd_pins axi_ethernet_0/clk312]
connect_bd_net [get_bd_pins axi_ethernet_0/interrupt] [get_bd_pins sys_concat_intc/In1]
connect_bd_net [get_bd_pins axi_ethernet_idelayctrl/rdy] [get_bd_pins axi_ethernet_0/idelay_rdy_in]
connect_bd_net [get_bd_pins axi_iic_0/iic2intc_irpt] [get_bd_pins sys_concat_intc/In11]
connect_bd_net [get_bd_pins axi_hdmi_tx_0/vdma_fs] [get_bd_pins axi_vdma_0/mm2s_fsync] [get_bd_pins axi_hdmi_tx_0/vdma_fs_ret]
connect_bd_net [get_bd_pins axi_vdma_0/m_axis_mm2s_tdata] [get_bd_pins axi_hdmi_tx_0/vdma_data]
connect_bd_net [get_bd_pins axi_vdma_0/m_axis_mm2s_tvalid] [get_bd_pins axi_hdmi_tx_0/vdma_valid]
connect_bd_net [get_bd_pins axi_hdmi_tx_0/vdma_ready] [get_bd_pins axi_vdma_0/m_axis_mm2s_tready]
connect_bd_net [get_bd_pins axi_vdma_0/mm2s_introut] [get_bd_pins sys_concat_intc/In12]
connect_bd_net [get_bd_pins axi_hdmi_tx_0/hdmi_out_clk] [get_bd_ports hdmi_out_clk]
connect_bd_net [get_bd_pins axi_hdmi_tx_0/hdmi_16_hsync] [get_bd_ports hdmi_16_hsync]
connect_bd_net [get_bd_pins axi_hdmi_tx_0/hdmi_16_vsync] [get_bd_ports hdmi_16_vsync]
connect_bd_net [get_bd_pins axi_hdmi_tx_0/hdmi_16_data] [get_bd_ports hdmi_16_data]
connect_bd_net [get_bd_pins axi_hdmi_tx_0/hdmi_16_data_e] [get_bd_ports hdmi_16_data_e]
connect_bd_net -net axi_ddr_cntrl_addn_ui_clkout2 [get_bd_pins axi_clkgen_0/clk_0] [get_bd_pins axi_hdmi_tx_0/hdmi_clk]
connect_bd_net -net sys_cpu_clk [get_bd_pins axi_ddr_cntrl/addn_ui_clkout1] \
  [get_bd_pins sys_rstgen/slowest_sync_clk] [get_bd_pins sys_mb/Clk] [get_bd_pins sys_mb_debug/S_AXI_ACLK] \
  [get_bd_pins axi_ethernet_dma/s_axi_lite_aclk] [get_bd_pins axi_timer/s_axi_aclk] [get_bd_pins axi_intc/s_axi_aclk] \
  [get_bd_pins axi_ethernet_dma/m_axi_sg_aclk] [get_bd_pins axi_ethernet_dma/m_axi_mm2s_aclk] \
  [get_bd_pins axi_ethernet_dma/m_axi_s2mm_aclk] [get_bd_pins axi_uartlite_0/s_axi_aclk] \
  [get_bd_pins axi_quad_spi_0/s_axi_aclk] [get_bd_pins axi_ethernet_0/axis_clk] [get_bd_pins axi_ethernet_0/s_axi_lite_clk] \
  [get_bd_pins axi_iic_0/s_axi_aclk] [get_bd_pins axi_vdma_0/s_axi_lite_aclk] [get_bd_pins axi_gpio_0/s_axi_aclk] \
  [get_bd_pins axi_vdma_0/m_axi_mm2s_aclk] [get_bd_pins axi_vdma_0/m_axis_mm2s_aclk] [get_bd_pins axi_hdmi_tx_0/s_axi_aclk] \
  [get_bd_pins axi_clkgen_0/s_axi_aclk] [get_bd_pins axi_hdmi_tx_0/vdma_clk] [get_bd_pins axis_data_fifo_0/m_axis_aclk] \
  [get_bd_pins ila_0/clk] [get_bd_pins BeamformerIP_0/fifo_axis_aclk] [get_bd_pins BeamformerIP_0/s00_axi_aclk] \
  [get_bd_pins BeamformerIP_0/m00_axi_aclk] [get_bd_pins axi_cpu_interconnect/ACLK] \
  [get_bd_pins axi_cpu_interconnect/S00_ACLK] [get_bd_pins axi_cpu_interconnect/M00_ACLK] \
  [get_bd_pins axi_cpu_interconnect/M01_ACLK] [get_bd_pins axi_cpu_interconnect/M02_ACLK] \
  [get_bd_pins axi_cpu_interconnect/M03_ACLK] [get_bd_pins axi_cpu_interconnect/M04_ACLK] \
  [get_bd_pins axi_cpu_interconnect/M05_ACLK] [get_bd_pins microblaze_0_local_memory/LMB_Clk] \
  [get_bd_pins axi_cpu_interconnect/M06_ACLK] [get_bd_pins axi_cpu_interconnect/S01_ACLK] \
  [get_bd_pins axi_cpu_interconnect/S02_ACLK] [get_bd_pins axi_cpu_interconnect/S03_ACLK] \
  [get_bd_pins axi_cpu_interconnect/S04_ACLK] [get_bd_pins axi_cpu_interconnect/M08_ACLK] \
  [get_bd_pins axi_cpu_interconnect/M09_ACLK] [get_bd_pins axi_cpu_interconnect/M10_ACLK] \
  [get_bd_pins axi_cpu_interconnect/M11_ACLK] [get_bd_pins axi_cpu_interconnect/M12_ACLK] \
  [get_bd_pins axi_cpu_interconnect/S05_ACLK] [get_bd_pins axi_cpu_interconnect/M13_ACLK] \
  [get_bd_pins axi_cpu_interconnect/S06_ACLK] [get_bd_pins axi_cpu_interconnect/M14_ACLK] \
  [get_bd_pins axi_interconnect_0/ACLK] [get_bd_pins axi_interconnect_0/S00_ACLK] [get_bd_pins axi_interconnect_0/S01_ACLK] \
  [get_bd_pins axi_interconnect_0/S02_ACLK] [get_bd_pins axi_interconnect_0/S03_ACLK] \
  [get_bd_pins axi_cpu_interconnect/M07_ACLK] [get_bd_pins ScanConverterIP_0/s00_axi_aclk] \
  [get_bd_pins ScanConverterIP_0/m00_axi_aclk]
connect_bd_net [get_bd_pins axi_ethernet_clkgen/clk_out1] [get_bd_pins axi_ethernet_rstgen/slowest_sync_clk] [get_bd_pins axi_ethernet_0/clk125m]
connect_bd_net [get_bd_pins axi_ddr_cntrl/addn_ui_clkout2] \
  [get_bd_pins axi_clkgen_0/clk] [get_bd_pins aurora_8b10b_0/init_clk_in] [get_bd_pins aurora_8b10b_1/init_clk_in]
connect_bd_net [get_bd_pins aurora_8b10b_0/sys_reset_out] [get_bd_pins util_vector_logic_0/Op1]
connect_bd_net [get_bd_pins aurora_8b10b_0/rx_channel_up] [get_bd_ports rx_channel_up]
connect_bd_net [get_bd_pins util_vector_logic_0/Res] [get_bd_pins axis_data_fifo_0/s_axis_aresetn] [get_bd_pins sim_data_probe_0/reset]
connect_bd_net [get_bd_pins aurora_8b10b_0/user_clk_out] [get_bd_pins axis_data_fifo_0/s_axis_aclk]
connect_bd_net [get_bd_pins xlconstant_0/dout] [get_bd_pins aurora_8b10b_0/loopback]
connect_bd_net [get_bd_pins xlconstant_1/dout] [get_bd_pins aurora_8b10b_0/power_down]
# net axis_data_fifo_0_axis_data_count has one end: axis_data_fifo_0/axis_data_count
connect_bd_net [get_bd_pins xlconstant_2/dout] \
  [get_bd_pins axi_quad_spi_0/gsr] [get_bd_pins axi_quad_spi_0/gts] [get_bd_pins axi_quad_spi_0/usrcclkts]
connect_bd_net [get_bd_pins xlconstant_3/dout] \
  [get_bd_pins axi_quad_spi_0/usrdoneo] [get_bd_pins axi_quad_spi_0/usrdonets] [get_bd_pins axi_quad_spi_0/keyclearb]
connect_bd_net [get_bd_pins xlconstant_4/dout] [get_bd_pins axi_ethernet_0/signal_detect]
connect_bd_net [get_bd_pins aurora_8b10b_0/gt_refclk1_out] [get_bd_pins aurora_8b10b_1/gt_refclk1]
connect_bd_net [get_bd_pins aurora_8b10b_0/gt_reset_out] [get_bd_pins aurora_8b10b_1/gt_reset]
connect_bd_net [get_bd_pins xlconstant_5/dout] [get_bd_pins aurora_8b10b_1/s_axi_tx_tlast]
connect_bd_net [get_bd_pins xlconstant_6/dout] [get_bd_pins aurora_8b10b_1/s_axi_tx_tkeep]
connect_bd_net [get_bd_pins xlconstant_7/dout] [get_bd_pins aurora_8b10b_1/power_down]
connect_bd_net [get_bd_pins xlconstant_8/dout] [get_bd_pins aurora_8b10b_1/loopback]
connect_bd_net [get_bd_pins sim_data_probe_0/axis_tdata] [get_bd_pins aurora_8b10b_1/s_axi_tx_tdata]
connect_bd_net [get_bd_pins sim_data_probe_0/axis_tvalid] [get_bd_pins aurora_8b10b_1/s_axi_tx_tvalid]
connect_bd_net [get_bd_pins aurora_8b10b_1/s_axi_tx_tready] [get_bd_pins sim_data_probe_0/axis_tready]
connect_bd_net [get_bd_pins aurora_8b10b_1/user_clk_out] [get_bd_pins sim_data_probe_0/axis_aclk]
connect_bd_net -net reset_button_1 [get_bd_ports aurora_reset_button] [get_bd_pins aurora_8b10b_0/gt_reset]
connect_bd_net [get_bd_pins axis_data_fifo_0/axis_rd_data_count] [get_bd_pins BeamformerIP_0/fifo_axis_rd_data_count]
connect_bd_net [get_bd_pins axis_data_fifo_0/m_axis_tdata] [get_bd_pins ila_0/probe0] [get_bd_pins BeamformerIP_0/fifo_axis_tdata]
connect_bd_net [get_bd_pins axis_data_fifo_0/m_axis_tvalid] [get_bd_pins ila_0/probe1] [get_bd_pins BeamformerIP_0/fifo_axis_tvalid]
connect_bd_net [get_bd_pins BeamformerIP_0/fifo_axis_tready] [get_bd_pins axis_data_fifo_0/m_axis_tready] [get_bd_pins ila_0/probe2]
connect_bd_net [get_bd_pins axi_ethernet_clkgen/clk_out5] [get_bd_pins axi_ethernet_idelayctrl/ref_clk]

# ---- address map ----
assign_bd_address -offset 0x40C00000 -range 256K -target_address_space [get_bd_addr_spaces axi_ethernet_dma/Data_MM2S] [get_bd_addr_segs axi_ethernet_0/s_axi/Reg0]
assign_bd_address -offset 0x41E00000 -range 64K -target_address_space [get_bd_addr_spaces axi_ethernet_dma/Data_MM2S] [get_bd_addr_segs axi_ethernet_dma/S_AXI_LITE/Reg]
assign_bd_address -offset 0x80000000 -range 2G -target_address_space [get_bd_addr_spaces axi_ethernet_dma/Data_MM2S] [get_bd_addr_segs axi_ddr_cntrl/C0_DDR4_MEMORY_MAP/C0_DDR4_ADDRESS_BLOCK]
exclude_bd_addr_seg -offset 0x40000000 -range 64K -target_address_space [get_bd_addr_spaces axi_ethernet_dma/Data_MM2S] [get_bd_addr_segs axi_gpio_0/S_AXI/Reg]
exclude_bd_addr_seg -offset 0x40600000 -range 64K -target_address_space [get_bd_addr_spaces axi_ethernet_dma/Data_MM2S] [get_bd_addr_segs axi_uartlite_0/S_AXI/Reg]
exclude_bd_addr_seg -offset 0x40800000 -range 64K -target_address_space [get_bd_addr_spaces axi_ethernet_dma/Data_MM2S] [get_bd_addr_segs axi_iic_0/S_AXI/Reg]
exclude_bd_addr_seg -offset 0x41200000 -range 64K -target_address_space [get_bd_addr_spaces axi_ethernet_dma/Data_MM2S] [get_bd_addr_segs axi_intc/s_axi/Reg]
exclude_bd_addr_seg -offset 0x41400000 -range 4K -target_address_space [get_bd_addr_spaces axi_ethernet_dma/Data_MM2S] [get_bd_addr_segs sys_mb_debug/S_AXI/Reg]
exclude_bd_addr_seg -offset 0x41C00000 -range 64K -target_address_space [get_bd_addr_spaces axi_ethernet_dma/Data_MM2S] [get_bd_addr_segs axi_timer/S_AXI/Reg]
exclude_bd_addr_seg -offset 0x44A00000 -range 64K -target_address_space [get_bd_addr_spaces axi_ethernet_dma/Data_MM2S] [get_bd_addr_segs BeamformerIP_0/s00_axi/reg0]
exclude_bd_addr_seg -offset 0x44A10000 -range 64K -target_address_space [get_bd_addr_spaces axi_ethernet_dma/Data_MM2S] [get_bd_addr_segs axi_quad_spi_0/AXI_LITE/Reg]
exclude_bd_addr_seg -offset 0x44A20000 -range 64K -target_address_space [get_bd_addr_spaces axi_ethernet_dma/Data_MM2S] [get_bd_addr_segs axi_vdma_0/S_AXI_LITE/Reg]
exclude_bd_addr_seg -offset 0x44A30000 -range 64K -target_address_space [get_bd_addr_spaces axi_ethernet_dma/Data_MM2S] [get_bd_addr_segs axi_hdmi_tx_0/s_axi/axi_lite]
exclude_bd_addr_seg -offset 0x44A40000 -range 64K -target_address_space [get_bd_addr_spaces axi_ethernet_dma/Data_MM2S] [get_bd_addr_segs axi_clkgen_0/s_axi/axi_lite]
exclude_bd_addr_seg -offset 0x44A50000 -range 64K -target_address_space [get_bd_addr_spaces axi_ethernet_dma/Data_MM2S] [get_bd_addr_segs ScanConverterIP_0/s00_axi/reg0]
assign_bd_address -offset 0x40C00000 -range 256K -target_address_space [get_bd_addr_spaces axi_ethernet_dma/Data_S2MM] [get_bd_addr_segs axi_ethernet_0/s_axi/Reg0]
assign_bd_address -offset 0x41E00000 -range 64K -target_address_space [get_bd_addr_spaces axi_ethernet_dma/Data_S2MM] [get_bd_addr_segs axi_ethernet_dma/S_AXI_LITE/Reg]
assign_bd_address -offset 0x80000000 -range 2G -target_address_space [get_bd_addr_spaces axi_ethernet_dma/Data_S2MM] [get_bd_addr_segs axi_ddr_cntrl/C0_DDR4_MEMORY_MAP/C0_DDR4_ADDRESS_BLOCK]
exclude_bd_addr_seg -offset 0x40000000 -range 64K -target_address_space [get_bd_addr_spaces axi_ethernet_dma/Data_S2MM] [get_bd_addr_segs axi_gpio_0/S_AXI/Reg]
exclude_bd_addr_seg -offset 0x40600000 -range 64K -target_address_space [get_bd_addr_spaces axi_ethernet_dma/Data_S2MM] [get_bd_addr_segs axi_uartlite_0/S_AXI/Reg]
exclude_bd_addr_seg -offset 0x40800000 -range 64K -target_address_space [get_bd_addr_spaces axi_ethernet_dma/Data_S2MM] [get_bd_addr_segs axi_iic_0/S_AXI/Reg]
exclude_bd_addr_seg -offset 0x41200000 -range 64K -target_address_space [get_bd_addr_spaces axi_ethernet_dma/Data_S2MM] [get_bd_addr_segs axi_intc/s_axi/Reg]
exclude_bd_addr_seg -offset 0x41400000 -range 4K -target_address_space [get_bd_addr_spaces axi_ethernet_dma/Data_S2MM] [get_bd_addr_segs sys_mb_debug/S_AXI/Reg]
exclude_bd_addr_seg -offset 0x41C00000 -range 64K -target_address_space [get_bd_addr_spaces axi_ethernet_dma/Data_S2MM] [get_bd_addr_segs axi_timer/S_AXI/Reg]
exclude_bd_addr_seg -offset 0x44A00000 -range 64K -target_address_space [get_bd_addr_spaces axi_ethernet_dma/Data_S2MM] [get_bd_addr_segs BeamformerIP_0/s00_axi/reg0]
exclude_bd_addr_seg -offset 0x44A10000 -range 64K -target_address_space [get_bd_addr_spaces axi_ethernet_dma/Data_S2MM] [get_bd_addr_segs axi_quad_spi_0/AXI_LITE/Reg]
exclude_bd_addr_seg -offset 0x44A20000 -range 64K -target_address_space [get_bd_addr_spaces axi_ethernet_dma/Data_S2MM] [get_bd_addr_segs axi_vdma_0/S_AXI_LITE/Reg]
exclude_bd_addr_seg -offset 0x44A30000 -range 64K -target_address_space [get_bd_addr_spaces axi_ethernet_dma/Data_S2MM] [get_bd_addr_segs axi_hdmi_tx_0/s_axi/axi_lite]
exclude_bd_addr_seg -offset 0x44A40000 -range 64K -target_address_space [get_bd_addr_spaces axi_ethernet_dma/Data_S2MM] [get_bd_addr_segs axi_clkgen_0/s_axi/axi_lite]
exclude_bd_addr_seg -offset 0x44A50000 -range 64K -target_address_space [get_bd_addr_spaces axi_ethernet_dma/Data_S2MM] [get_bd_addr_segs ScanConverterIP_0/s00_axi/reg0]
assign_bd_address -offset 0x40C00000 -range 256K -target_address_space [get_bd_addr_spaces axi_ethernet_dma/Data_SG] [get_bd_addr_segs axi_ethernet_0/s_axi/Reg0]
assign_bd_address -offset 0x41E00000 -range 64K -target_address_space [get_bd_addr_spaces axi_ethernet_dma/Data_SG] [get_bd_addr_segs axi_ethernet_dma/S_AXI_LITE/Reg]
assign_bd_address -offset 0x80000000 -range 2G -target_address_space [get_bd_addr_spaces axi_ethernet_dma/Data_SG] [get_bd_addr_segs axi_ddr_cntrl/C0_DDR4_MEMORY_MAP/C0_DDR4_ADDRESS_BLOCK]
exclude_bd_addr_seg -offset 0x40000000 -range 64K -target_address_space [get_bd_addr_spaces axi_ethernet_dma/Data_SG] [get_bd_addr_segs axi_gpio_0/S_AXI/Reg]
exclude_bd_addr_seg -offset 0x40600000 -range 64K -target_address_space [get_bd_addr_spaces axi_ethernet_dma/Data_SG] [get_bd_addr_segs axi_uartlite_0/S_AXI/Reg]
exclude_bd_addr_seg -offset 0x40800000 -range 64K -target_address_space [get_bd_addr_spaces axi_ethernet_dma/Data_SG] [get_bd_addr_segs axi_iic_0/S_AXI/Reg]
exclude_bd_addr_seg -offset 0x41200000 -range 64K -target_address_space [get_bd_addr_spaces axi_ethernet_dma/Data_SG] [get_bd_addr_segs axi_intc/s_axi/Reg]
exclude_bd_addr_seg -offset 0x41400000 -range 4K -target_address_space [get_bd_addr_spaces axi_ethernet_dma/Data_SG] [get_bd_addr_segs sys_mb_debug/S_AXI/Reg]
exclude_bd_addr_seg -offset 0x41C00000 -range 64K -target_address_space [get_bd_addr_spaces axi_ethernet_dma/Data_SG] [get_bd_addr_segs axi_timer/S_AXI/Reg]
exclude_bd_addr_seg -offset 0x44A00000 -range 64K -target_address_space [get_bd_addr_spaces axi_ethernet_dma/Data_SG] [get_bd_addr_segs BeamformerIP_0/s00_axi/reg0]
exclude_bd_addr_seg -offset 0x44A10000 -range 64K -target_address_space [get_bd_addr_spaces axi_ethernet_dma/Data_SG] [get_bd_addr_segs axi_quad_spi_0/AXI_LITE/Reg]
exclude_bd_addr_seg -offset 0x44A20000 -range 64K -target_address_space [get_bd_addr_spaces axi_ethernet_dma/Data_SG] [get_bd_addr_segs axi_vdma_0/S_AXI_LITE/Reg]
exclude_bd_addr_seg -offset 0x44A30000 -range 64K -target_address_space [get_bd_addr_spaces axi_ethernet_dma/Data_SG] [get_bd_addr_segs axi_hdmi_tx_0/s_axi/axi_lite]
exclude_bd_addr_seg -offset 0x44A40000 -range 64K -target_address_space [get_bd_addr_spaces axi_ethernet_dma/Data_SG] [get_bd_addr_segs axi_clkgen_0/s_axi/axi_lite]
exclude_bd_addr_seg -offset 0x44A50000 -range 64K -target_address_space [get_bd_addr_spaces axi_ethernet_dma/Data_SG] [get_bd_addr_segs ScanConverterIP_0/s00_axi/reg0]
assign_bd_address -offset 0x80000000 -range 2G -target_address_space [get_bd_addr_spaces axi_vdma_0/Data_MM2S] [get_bd_addr_segs axi_ddr_cntrl/C0_DDR4_MEMORY_MAP/C0_DDR4_ADDRESS_BLOCK]
exclude_bd_addr_seg -offset 0x40000000 -range 64K -target_address_space [get_bd_addr_spaces axi_vdma_0/Data_MM2S] [get_bd_addr_segs axi_gpio_0/S_AXI/Reg]
exclude_bd_addr_seg -offset 0x40600000 -range 64K -target_address_space [get_bd_addr_spaces axi_vdma_0/Data_MM2S] [get_bd_addr_segs axi_uartlite_0/S_AXI/Reg]
exclude_bd_addr_seg -offset 0x40800000 -range 64K -target_address_space [get_bd_addr_spaces axi_vdma_0/Data_MM2S] [get_bd_addr_segs axi_iic_0/S_AXI/Reg]
exclude_bd_addr_seg -offset 0x40C00000 -range 256K -target_address_space [get_bd_addr_spaces axi_vdma_0/Data_MM2S] [get_bd_addr_segs axi_ethernet_0/s_axi/Reg0]
exclude_bd_addr_seg -offset 0x41200000 -range 64K -target_address_space [get_bd_addr_spaces axi_vdma_0/Data_MM2S] [get_bd_addr_segs axi_intc/s_axi/Reg]
exclude_bd_addr_seg -offset 0x41400000 -range 4K -target_address_space [get_bd_addr_spaces axi_vdma_0/Data_MM2S] [get_bd_addr_segs sys_mb_debug/S_AXI/Reg]
exclude_bd_addr_seg -offset 0x41C00000 -range 64K -target_address_space [get_bd_addr_spaces axi_vdma_0/Data_MM2S] [get_bd_addr_segs axi_timer/S_AXI/Reg]
exclude_bd_addr_seg -offset 0x41E00000 -range 64K -target_address_space [get_bd_addr_spaces axi_vdma_0/Data_MM2S] [get_bd_addr_segs axi_ethernet_dma/S_AXI_LITE/Reg]
exclude_bd_addr_seg -offset 0x44A00000 -range 64K -target_address_space [get_bd_addr_spaces axi_vdma_0/Data_MM2S] [get_bd_addr_segs BeamformerIP_0/s00_axi/reg0]
exclude_bd_addr_seg -offset 0x44A10000 -range 64K -target_address_space [get_bd_addr_spaces axi_vdma_0/Data_MM2S] [get_bd_addr_segs axi_quad_spi_0/AXI_LITE/Reg]
exclude_bd_addr_seg -offset 0x44A20000 -range 64K -target_address_space [get_bd_addr_spaces axi_vdma_0/Data_MM2S] [get_bd_addr_segs axi_vdma_0/S_AXI_LITE/Reg]
exclude_bd_addr_seg -offset 0x44A30000 -range 64K -target_address_space [get_bd_addr_spaces axi_vdma_0/Data_MM2S] [get_bd_addr_segs axi_hdmi_tx_0/s_axi/axi_lite]
exclude_bd_addr_seg -offset 0x44A40000 -range 64K -target_address_space [get_bd_addr_spaces axi_vdma_0/Data_MM2S] [get_bd_addr_segs axi_clkgen_0/s_axi/axi_lite]
exclude_bd_addr_seg -offset 0x44A50000 -range 64K -target_address_space [get_bd_addr_spaces axi_vdma_0/Data_MM2S] [get_bd_addr_segs ScanConverterIP_0/s00_axi/reg0]
assign_bd_address -offset 0x40000000 -range 64K -target_address_space [get_bd_addr_spaces BeamformerIP_0/m00_axi] [get_bd_addr_segs axi_gpio_0/S_AXI/Reg]
assign_bd_address -offset 0x40600000 -range 64K -target_address_space [get_bd_addr_spaces BeamformerIP_0/m00_axi] [get_bd_addr_segs axi_uartlite_0/S_AXI/Reg]
assign_bd_address -offset 0x40800000 -range 64K -target_address_space [get_bd_addr_spaces BeamformerIP_0/m00_axi] [get_bd_addr_segs axi_iic_0/S_AXI/Reg]
assign_bd_address -offset 0x40C00000 -range 256K -target_address_space [get_bd_addr_spaces BeamformerIP_0/m00_axi] [get_bd_addr_segs axi_ethernet_0/s_axi/Reg0]
assign_bd_address -offset 0x41200000 -range 64K -target_address_space [get_bd_addr_spaces BeamformerIP_0/m00_axi] [get_bd_addr_segs axi_intc/s_axi/Reg]
assign_bd_address -offset 0x41400000 -range 4K -target_address_space [get_bd_addr_spaces BeamformerIP_0/m00_axi] [get_bd_addr_segs sys_mb_debug/S_AXI/Reg]
assign_bd_address -offset 0x41C00000 -range 64K -target_address_space [get_bd_addr_spaces BeamformerIP_0/m00_axi] [get_bd_addr_segs axi_timer/S_AXI/Reg]
assign_bd_address -offset 0x41E00000 -range 64K -target_address_space [get_bd_addr_spaces BeamformerIP_0/m00_axi] [get_bd_addr_segs axi_ethernet_dma/S_AXI_LITE/Reg]
assign_bd_address -offset 0x44A00000 -range 64K -target_address_space [get_bd_addr_spaces BeamformerIP_0/m00_axi] [get_bd_addr_segs BeamformerIP_0/s00_axi/reg0]
assign_bd_address -offset 0x44A10000 -range 64K -target_address_space [get_bd_addr_spaces BeamformerIP_0/m00_axi] [get_bd_addr_segs axi_quad_spi_0/AXI_LITE/Reg]
assign_bd_address -offset 0x44A20000 -range 64K -target_address_space [get_bd_addr_spaces BeamformerIP_0/m00_axi] [get_bd_addr_segs axi_vdma_0/S_AXI_LITE/Reg]
assign_bd_address -offset 0x44A30000 -range 64K -target_address_space [get_bd_addr_spaces BeamformerIP_0/m00_axi] [get_bd_addr_segs axi_hdmi_tx_0/s_axi/axi_lite]
assign_bd_address -offset 0x44A40000 -range 64K -target_address_space [get_bd_addr_spaces BeamformerIP_0/m00_axi] [get_bd_addr_segs axi_clkgen_0/s_axi/axi_lite]
assign_bd_address -offset 0x44A50000 -range 64K -target_address_space [get_bd_addr_spaces BeamformerIP_0/m00_axi] [get_bd_addr_segs ScanConverterIP_0/s00_axi/reg0]
assign_bd_address -offset 0x80000000 -range 2G -target_address_space [get_bd_addr_spaces BeamformerIP_0/m00_axi] [get_bd_addr_segs axi_ddr_cntrl/C0_DDR4_MEMORY_MAP/C0_DDR4_ADDRESS_BLOCK]
assign_bd_address -offset 0x40000000 -range 64K -target_address_space [get_bd_addr_spaces ScanConverterIP_0/m00_axi] [get_bd_addr_segs axi_gpio_0/S_AXI/Reg]
assign_bd_address -offset 0x40600000 -range 64K -target_address_space [get_bd_addr_spaces ScanConverterIP_0/m00_axi] [get_bd_addr_segs axi_uartlite_0/S_AXI/Reg]
assign_bd_address -offset 0x40800000 -range 64K -target_address_space [get_bd_addr_spaces ScanConverterIP_0/m00_axi] [get_bd_addr_segs axi_iic_0/S_AXI/Reg]
assign_bd_address -offset 0x40C00000 -range 256K -target_address_space [get_bd_addr_spaces ScanConverterIP_0/m00_axi] [get_bd_addr_segs axi_ethernet_0/s_axi/Reg0]
assign_bd_address -offset 0x41200000 -range 64K -target_address_space [get_bd_addr_spaces ScanConverterIP_0/m00_axi] [get_bd_addr_segs axi_intc/s_axi/Reg]
assign_bd_address -offset 0x41400000 -range 4K -target_address_space [get_bd_addr_spaces ScanConverterIP_0/m00_axi] [get_bd_addr_segs sys_mb_debug/S_AXI/Reg]
assign_bd_address -offset 0x41C00000 -range 64K -target_address_space [get_bd_addr_spaces ScanConverterIP_0/m00_axi] [get_bd_addr_segs axi_timer/S_AXI/Reg]
assign_bd_address -offset 0x41E00000 -range 64K -target_address_space [get_bd_addr_spaces ScanConverterIP_0/m00_axi] [get_bd_addr_segs axi_ethernet_dma/S_AXI_LITE/Reg]
assign_bd_address -offset 0x44A00000 -range 64K -target_address_space [get_bd_addr_spaces ScanConverterIP_0/m00_axi] [get_bd_addr_segs BeamformerIP_0/s00_axi/reg0]
assign_bd_address -offset 0x44A10000 -range 64K -target_address_space [get_bd_addr_spaces ScanConverterIP_0/m00_axi] [get_bd_addr_segs axi_quad_spi_0/AXI_LITE/Reg]
assign_bd_address -offset 0x44A20000 -range 64K -target_address_space [get_bd_addr_spaces ScanConverterIP_0/m00_axi] [get_bd_addr_segs axi_vdma_0/S_AXI_LITE/Reg]
assign_bd_address -offset 0x44A30000 -range 64K -target_address_space [get_bd_addr_spaces ScanConverterIP_0/m00_axi] [get_bd_addr_segs axi_hdmi_tx_0/s_axi/axi_lite]
assign_bd_address -offset 0x44A40000 -range 64K -target_address_space [get_bd_addr_spaces ScanConverterIP_0/m00_axi] [get_bd_addr_segs axi_clkgen_0/s_axi/axi_lite]
assign_bd_address -offset 0x44A50000 -range 64K -target_address_space [get_bd_addr_spaces ScanConverterIP_0/m00_axi] [get_bd_addr_segs ScanConverterIP_0/s00_axi/reg0]
assign_bd_address -offset 0x80000000 -range 2G -target_address_space [get_bd_addr_spaces ScanConverterIP_0/m00_axi] [get_bd_addr_segs axi_ddr_cntrl/C0_DDR4_MEMORY_MAP/C0_DDR4_ADDRESS_BLOCK]
assign_bd_address -offset 0x00000000 -range 32K -target_address_space [get_bd_addr_spaces sys_mb/Data] [get_bd_addr_segs microblaze_0_local_memory/dlmb_bram_if_cntlr/SLMB/Mem]
assign_bd_address -offset 0x40000000 -range 64K -target_address_space [get_bd_addr_spaces sys_mb/Data] [get_bd_addr_segs axi_gpio_0/S_AXI/Reg]
assign_bd_address -offset 0x40600000 -range 64K -target_address_space [get_bd_addr_spaces sys_mb/Data] [get_bd_addr_segs axi_uartlite_0/S_AXI/Reg]
assign_bd_address -offset 0x40800000 -range 64K -target_address_space [get_bd_addr_spaces sys_mb/Data] [get_bd_addr_segs axi_iic_0/S_AXI/Reg]
assign_bd_address -offset 0x40C00000 -range 256K -target_address_space [get_bd_addr_spaces sys_mb/Data] [get_bd_addr_segs axi_ethernet_0/s_axi/Reg0]
assign_bd_address -offset 0x41200000 -range 64K -target_address_space [get_bd_addr_spaces sys_mb/Data] [get_bd_addr_segs axi_intc/s_axi/Reg]
assign_bd_address -offset 0x41400000 -range 4K -target_address_space [get_bd_addr_spaces sys_mb/Data] [get_bd_addr_segs sys_mb_debug/S_AXI/Reg]
assign_bd_address -offset 0x41C00000 -range 64K -target_address_space [get_bd_addr_spaces sys_mb/Data] [get_bd_addr_segs axi_timer/S_AXI/Reg]
assign_bd_address -offset 0x41E00000 -range 64K -target_address_space [get_bd_addr_spaces sys_mb/Data] [get_bd_addr_segs axi_ethernet_dma/S_AXI_LITE/Reg]
assign_bd_address -offset 0x44A00000 -range 64K -target_address_space [get_bd_addr_spaces sys_mb/Data] [get_bd_addr_segs BeamformerIP_0/s00_axi/reg0]
assign_bd_address -offset 0x44A10000 -range 64K -target_address_space [get_bd_addr_spaces sys_mb/Data] [get_bd_addr_segs axi_quad_spi_0/AXI_LITE/Reg]
assign_bd_address -offset 0x44A20000 -range 64K -target_address_space [get_bd_addr_spaces sys_mb/Data] [get_bd_addr_segs axi_vdma_0/S_AXI_LITE/Reg]
assign_bd_address -offset 0x44A30000 -range 64K -target_address_space [get_bd_addr_spaces sys_mb/Data] [get_bd_addr_segs axi_hdmi_tx_0/s_axi/axi_lite]
assign_bd_address -offset 0x44A40000 -range 64K -target_address_space [get_bd_addr_spaces sys_mb/Data] [get_bd_addr_segs axi_clkgen_0/s_axi/axi_lite]
assign_bd_address -offset 0x44A50000 -range 64K -target_address_space [get_bd_addr_spaces sys_mb/Data] [get_bd_addr_segs ScanConverterIP_0/s00_axi/reg0]
assign_bd_address -offset 0x80000000 -range 2G -target_address_space [get_bd_addr_spaces sys_mb/Data] [get_bd_addr_segs axi_ddr_cntrl/C0_DDR4_MEMORY_MAP/C0_DDR4_ADDRESS_BLOCK]
assign_bd_address -offset 0x00000000 -range 32K -target_address_space [get_bd_addr_spaces sys_mb/Instruction] [get_bd_addr_segs microblaze_0_local_memory/ilmb_bram_if_cntlr/SLMB/Mem]
assign_bd_address -offset 0x40000000 -range 64K -target_address_space [get_bd_addr_spaces sys_mb/Instruction] [get_bd_addr_segs axi_gpio_0/S_AXI/Reg]
assign_bd_address -offset 0x40600000 -range 64K -target_address_space [get_bd_addr_spaces sys_mb/Instruction] [get_bd_addr_segs axi_uartlite_0/S_AXI/Reg]
assign_bd_address -offset 0x40800000 -range 64K -target_address_space [get_bd_addr_spaces sys_mb/Instruction] [get_bd_addr_segs axi_iic_0/S_AXI/Reg]
